# EAGLE schematic uJOVE5 (EAGLE 9.2.1)

## Sheet 1 of 2
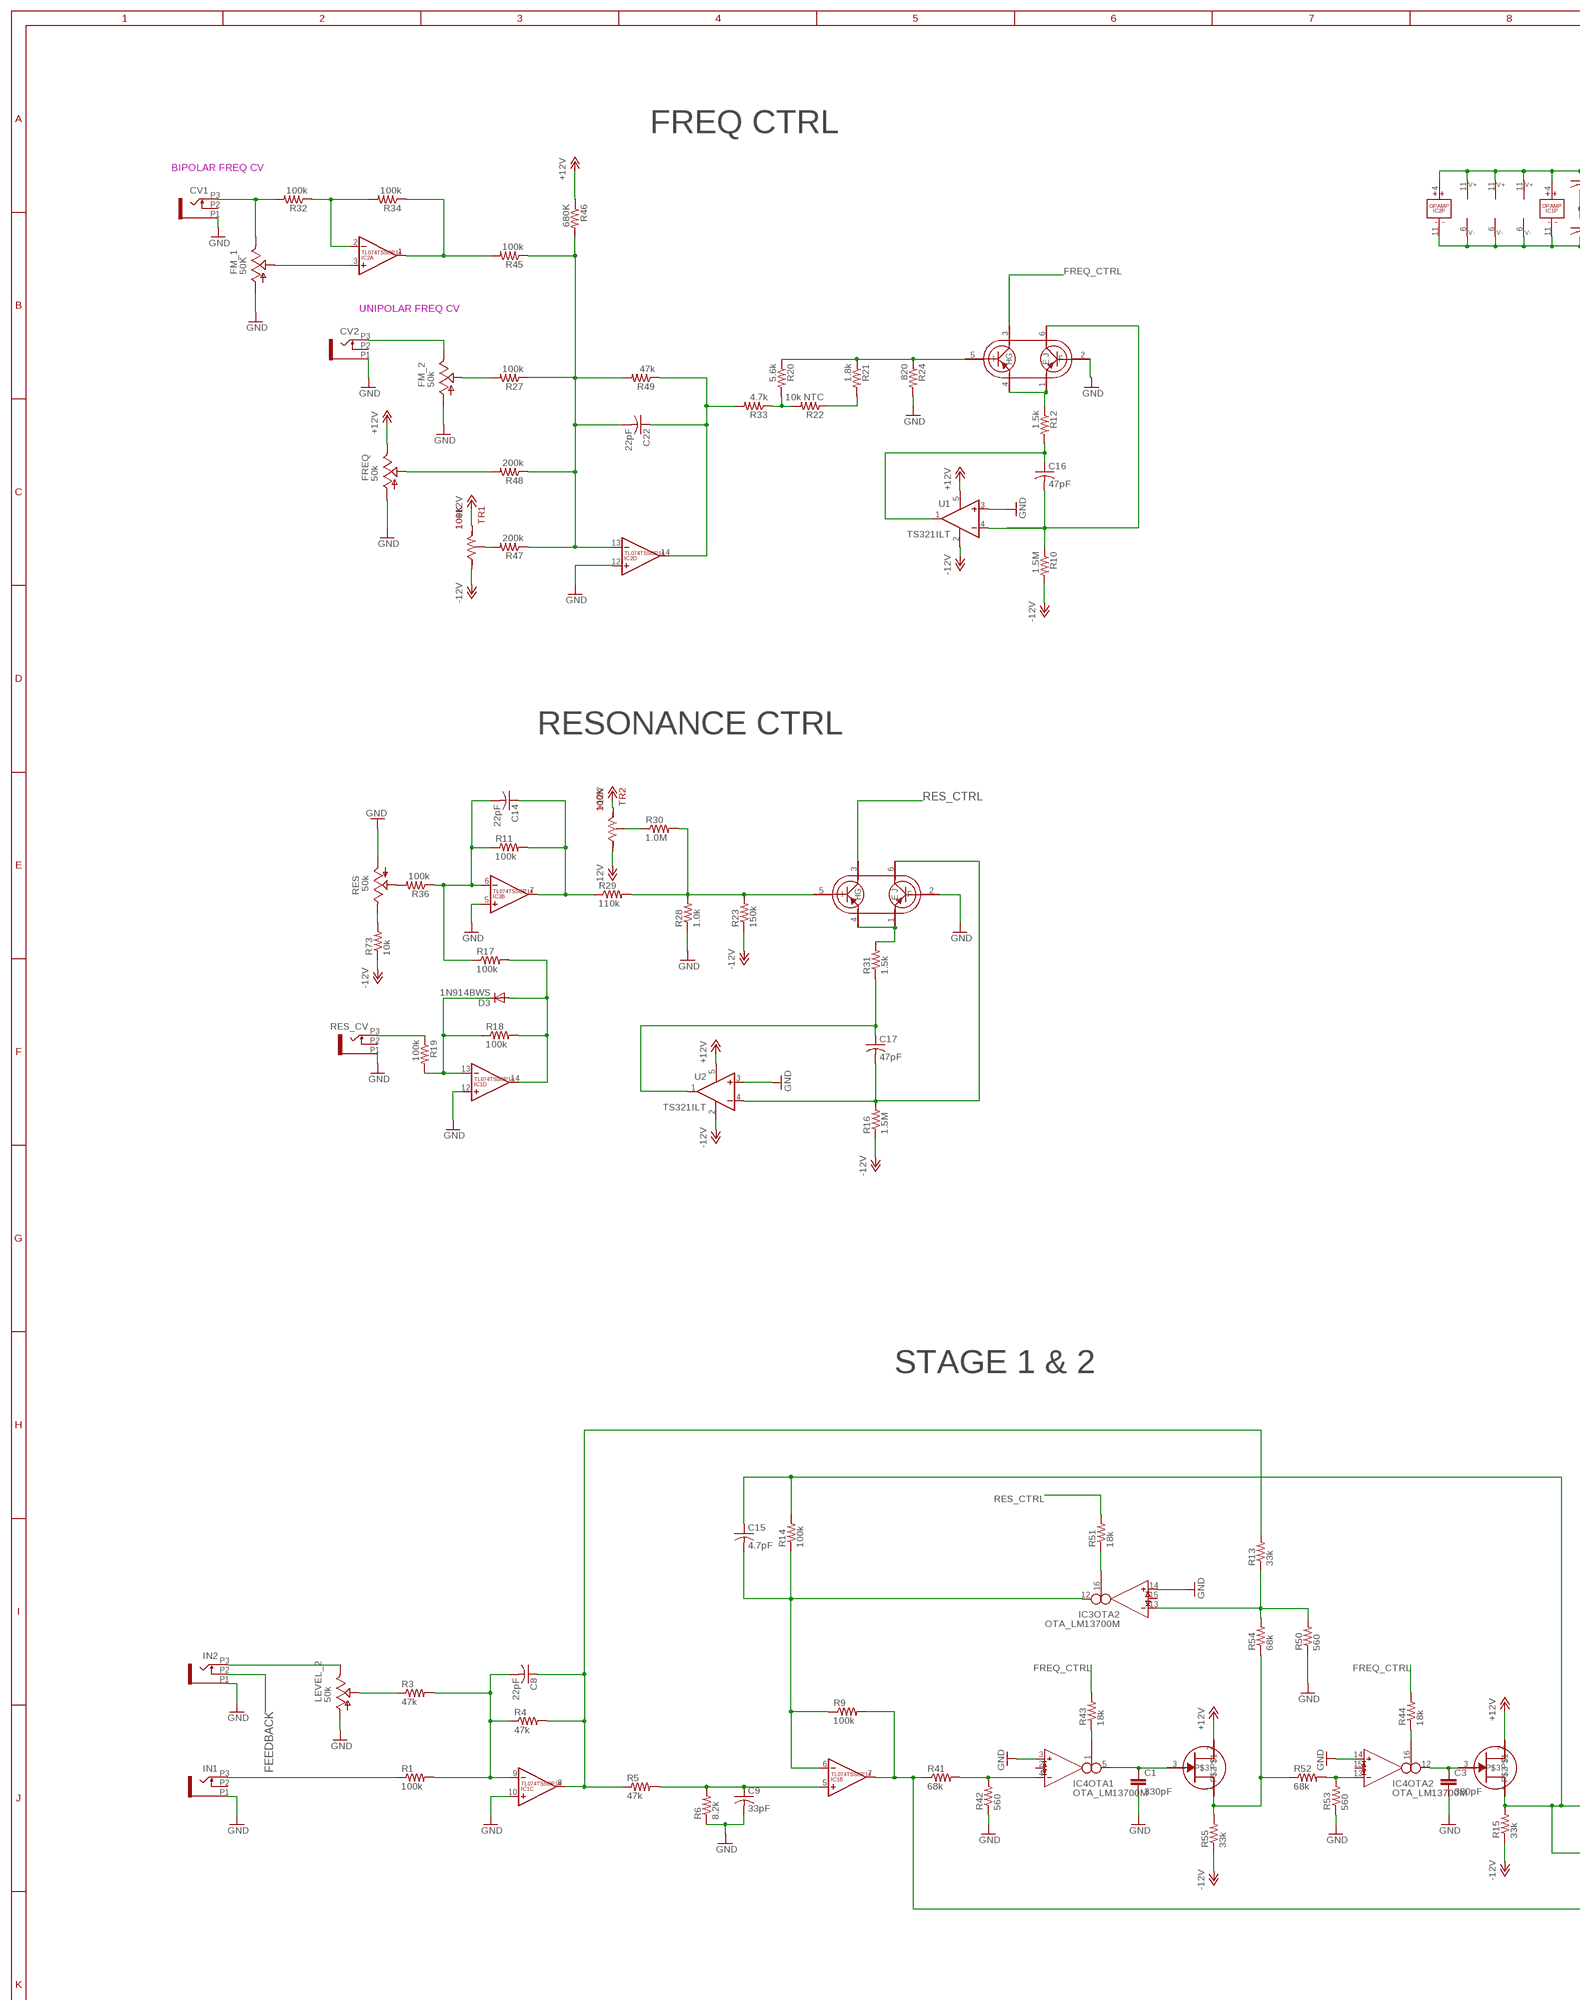
[diagram p0: schematic, sheet 1, part 1 of 3]
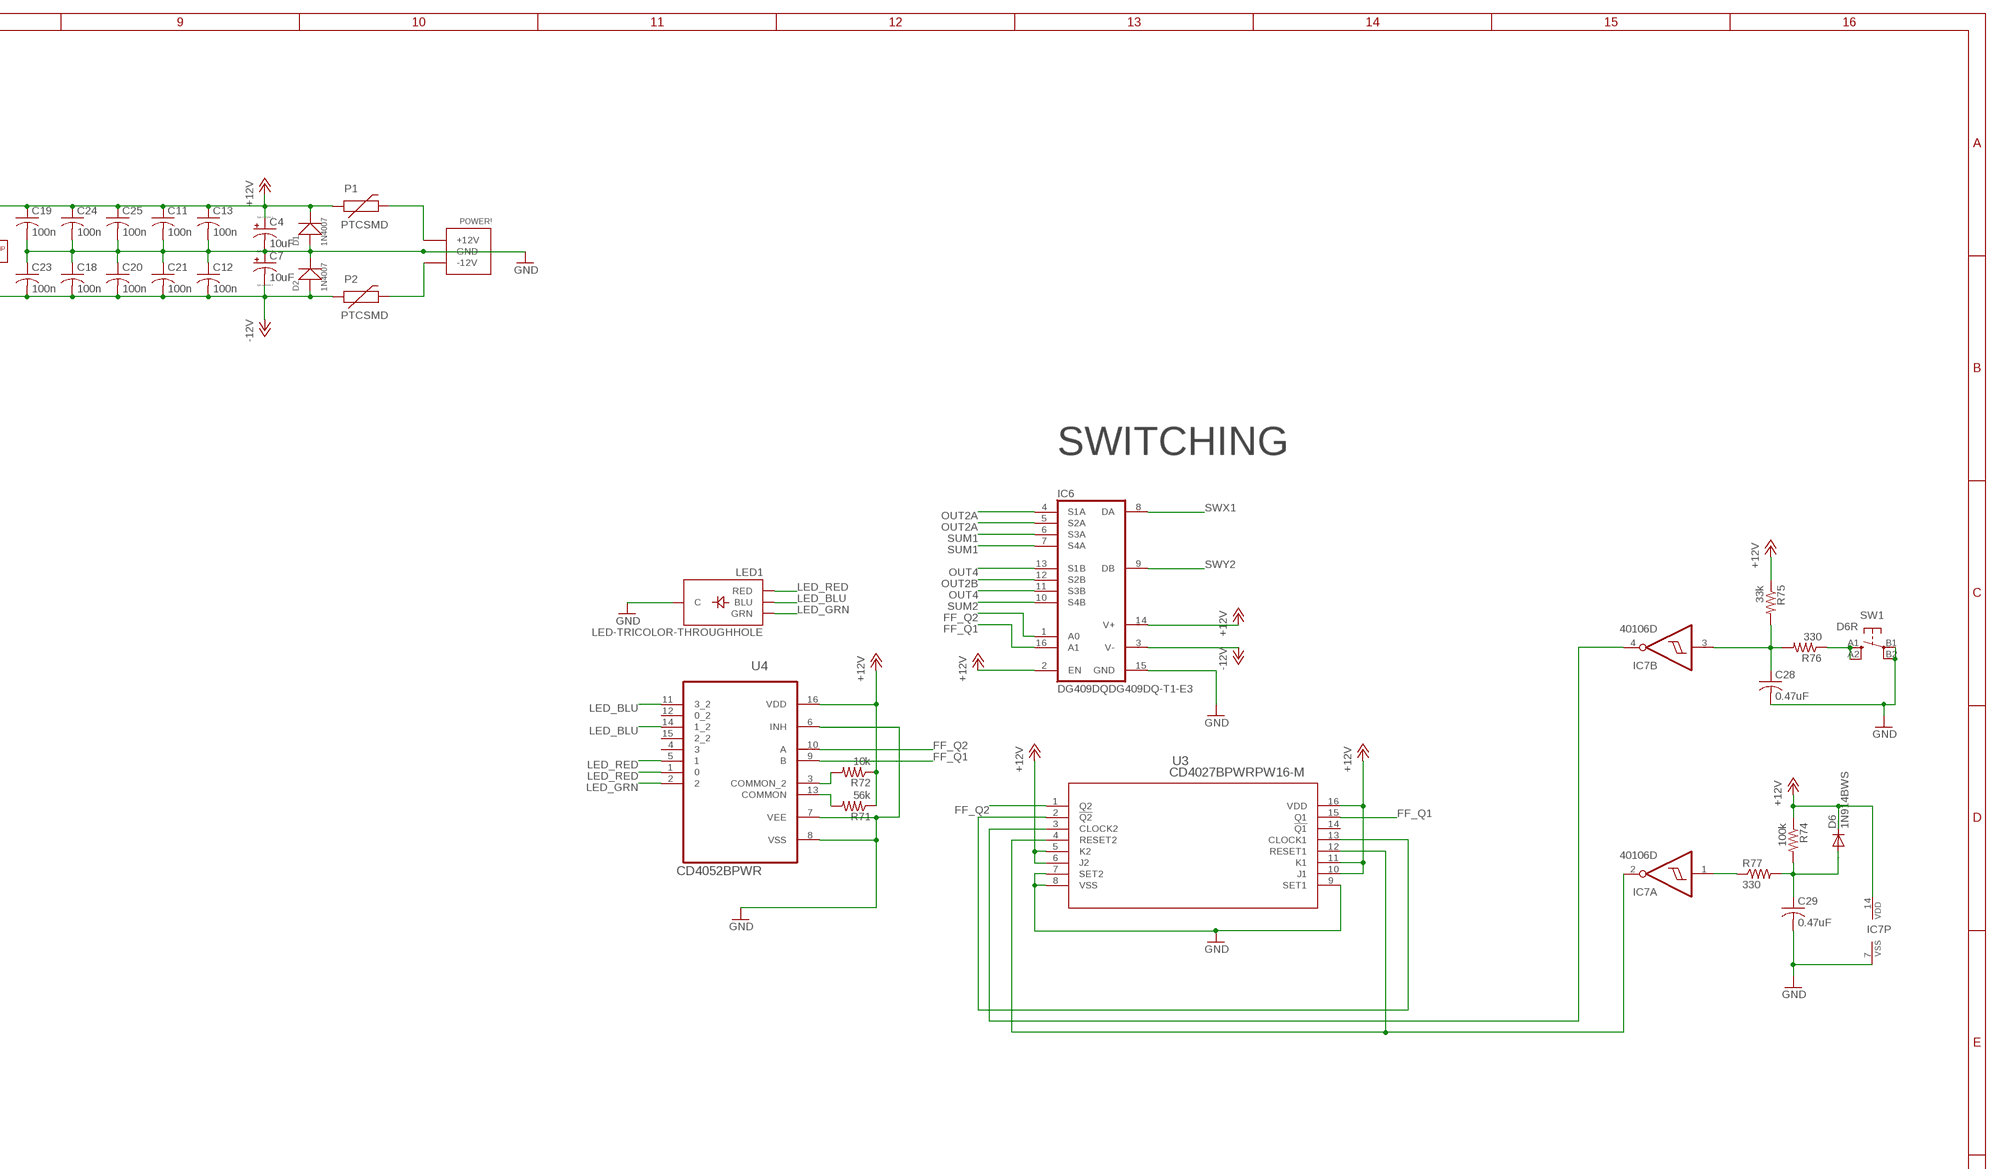
[diagram p1: schematic, sheet 1, part 2 of 3]
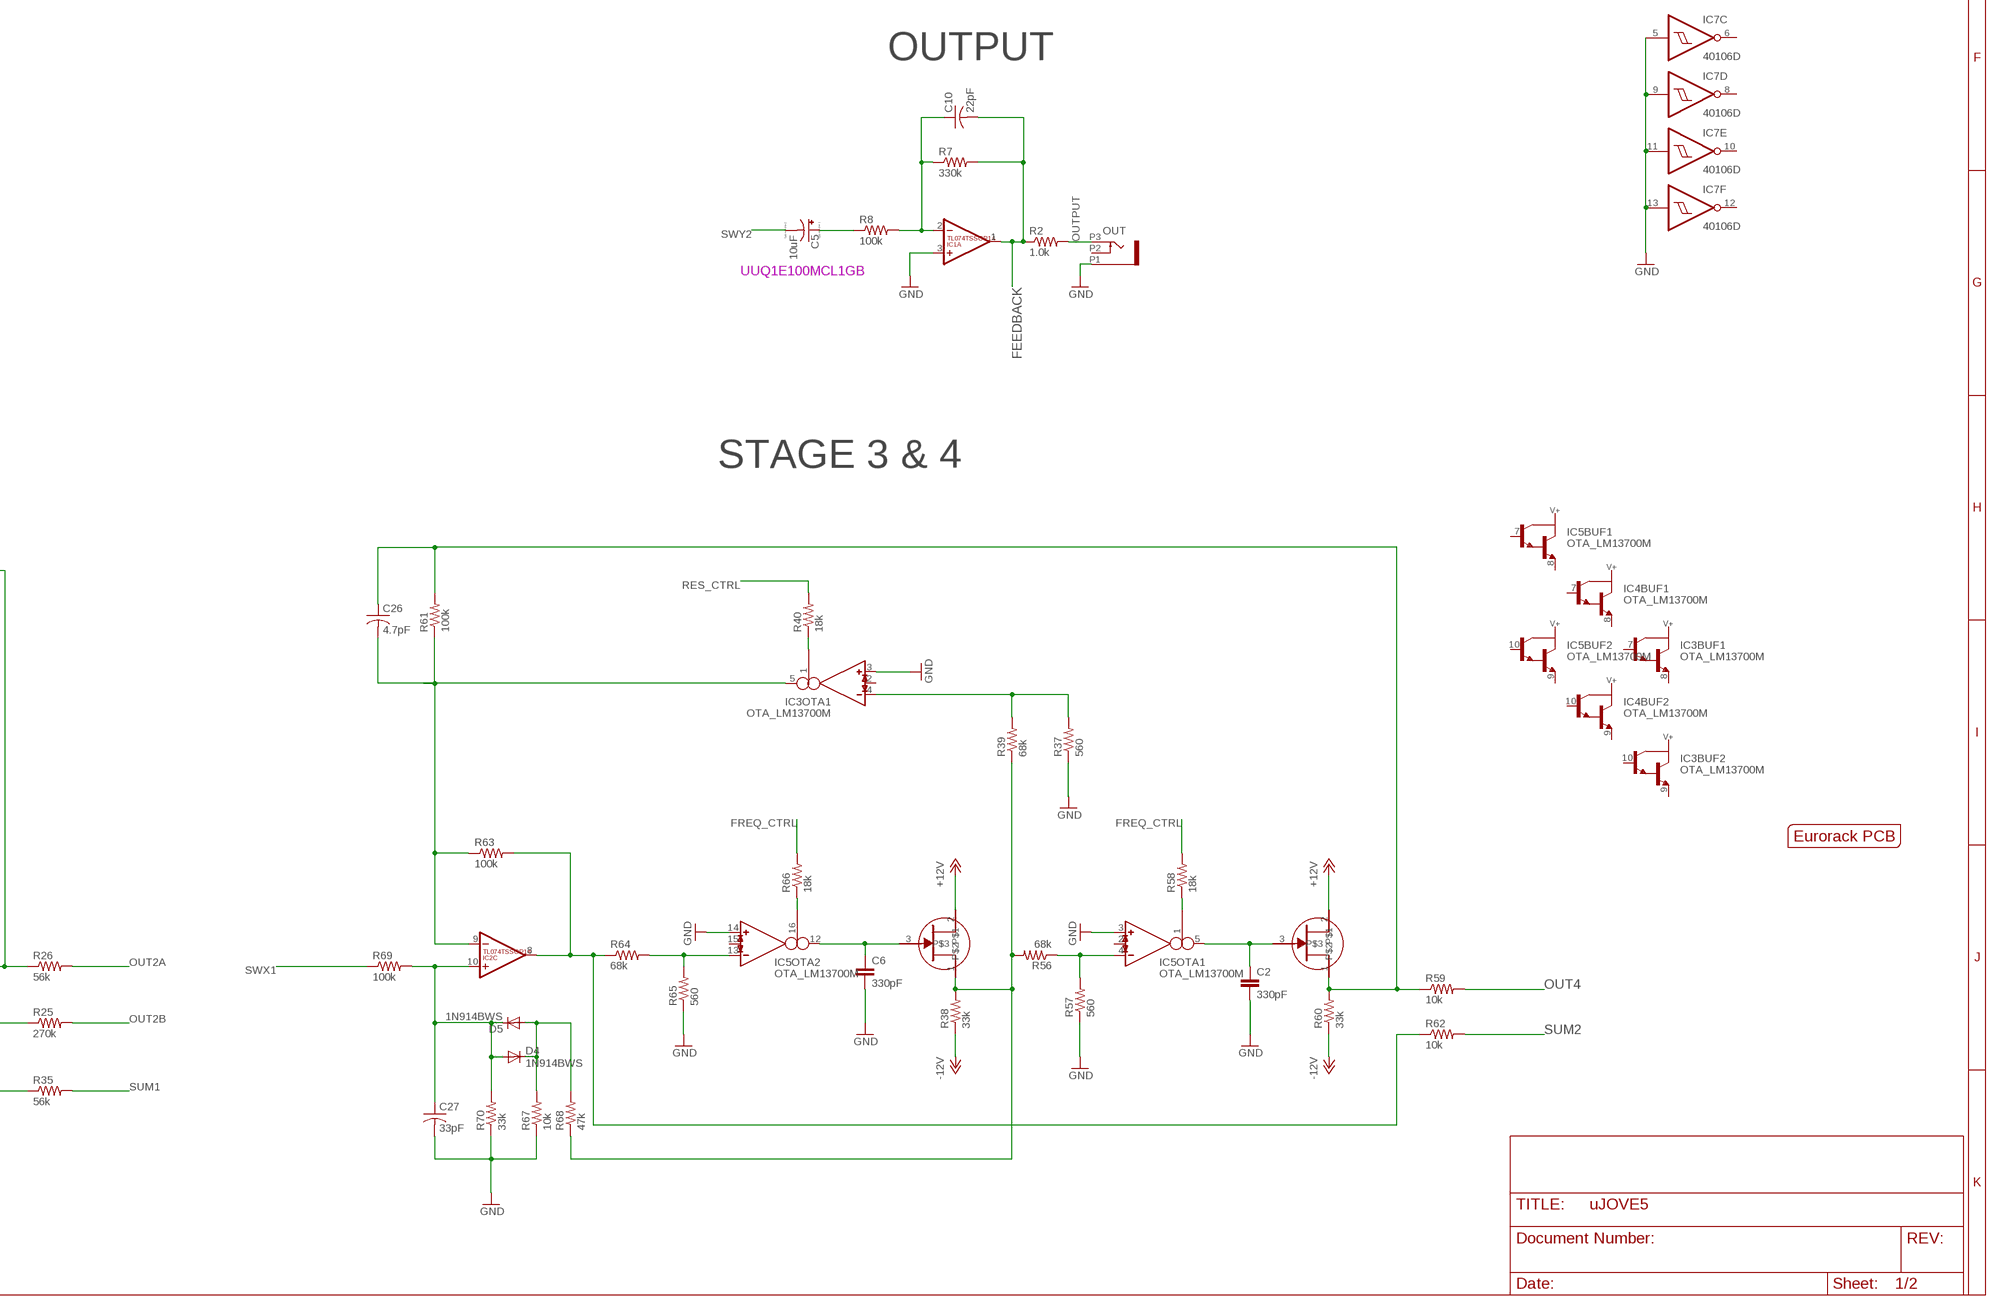
[diagram p2: schematic, sheet 1, part 3 of 3]

### Parts
C1  330pF  C5/5  [C5B5]
C2  330pF  C5/5  [C5B5]
C3  330pF  C5/5  [C5B5]
C4  10uF  CPOL-USC  [PANASONIC_C]
C5  10uF  CPOL-USC  [PANASONIC_C]
C6  330pF  C5/5  [C5B5]
C7  10uF  CPOL-USC  [PANASONIC_C]
C8  22pF  C-USC0603  [C0603]
C9  33pF  C-USC0603  [C0603]
C10  22pF  C-USC0603  [C0603]
C11  100n  C-USC0603  [C0603]
C12  100n  C-USC0603  [C0603]
C13  100n  C-USC0603  [C0603]
C14  22pF  C-USC0603  [C0603]
C15  4.7pF  C-USC0603  [C0603]
C16  47pF  C-USC0603  [C0603]
C17  47pF  C-USC0603  [C0603]
C18  100n  C-USC0603  [C0603]
C19  100n  C-USC0603  [C0603]
C20  100n  C-USC0603  [C0603]
C21  100n  C-USC0603  [C0603]
C22  22pF  C-USC0603  [C0603]
C23  100n  C-USC0603  [C0603]
C24  100n  C-USC0603  [C0603]
C25  100n  C-USC0603  [C0603]
C26  4.7pF  C-USC0603  [C0603]
C27  33pF  C-USC0603  [C0603]
C28  0.47uF  C-USC0603  [C0603]
C29  0.47uF  C-USC0603  [C0603]
CV1  OG-PJ301_PJ301_THONKICONN  [OG-PJ301_WQP_PJ_301M6_NO_HOLE]
CV2  OG-PJ301_PJ301_THONKICONN  [OG-PJ301_WQP_PJ_301M6_NO_HOLE]
D1  1N4007  DIODE-GEN-PURPOSE-1KV-1A(DO-214AC)  [DO-214AC]
D2  1N4007  DIODE-GEN-PURPOSE-1KV-1A(DO-214AC)  [DO-214AC]
D3  1N914BWS  DIODE-SOD323-R  [SOD323-R]
D4  1N914BWS  DIODE-SOD323-R  [SOD323-R]
D5  1N914BWS  DIODE-SOD323-R  [SOD323-R]
D6  1N914BWS  DIODE-SOD323-R  [SOD323-R]
FM_1  50K  OG-POTS_POT_USVERTICAL  [OG-POTS_ALPS_POT_VERTICAL]
FM_2  50k  OG-POTS_POT_USVERTICAL  [OG-POTS_ALPS_POT_VERTICAL]
FREQ  50k  OG-POTS_POT_USVERTICAL_PS  [OG-POTS_ALPS_POT_VERTICAL_PS]
IC1  TL074TSSOP14  [TSSOP14]
IC2  TL074TSSOP14  [TSSOP14]
IC3  OTA_LM13700M  [OTA_SO16]
IC4  OTA_LM13700M  [OTA_SO16]
IC5  OTA_LM13700M  [OTA_SO16]
IC6  DG409DQDG409DQ-T1-E3  [TSSOP16]
IC7  40106D  [SO14]
IN1  OG-PJ301_PJ301_THONKICONN  [OG-PJ301_WQP_PJ_301M6_NO_HOLE]
IN2  OG-PJ301_PJ301_THONKICONN  [OG-PJ301_WQP_PJ_301M6_NO_HOLE]
LED1  LED-TRICOLOR-THROUGHHOLE  [LED-TRICOLOR-THROUGHHOLE]
LEVEL_2  50k  OG-POTS_POT_USVERTICAL  [OG-POTS_ALPS_POT_VERTICAL]
OUT  OG-PJ301_PJ301_THONKICONN  [OG-PJ301_WQP_PJ_301M6_NO_HOLE]
P1  PTCSMD  [PTC-1206]
P2  PTCSMD  [PTC-1206]
PCB1  EURORACK_PCB  [EURORACK8HPPCB-S]
POWER!  POWER_SIMPLE  [2X05_SMT_HEADER]
Q1  BCM857BS  [SOT65P210X110-6N]
Q2  BCM857BS  [SOT65P210X110-6N]
Q3  MMBFJ112MMBFJ112  [SOT23]
Q4  MMBFJ112MMBFJ112  [SOT23]
Q5  MMBFJ112MMBFJ112  [SOT23]
Q6  MMBFJ112MMBFJ112  [SOT23]
R1  100k  R-US_R0603  [R0603]
R2  1.0k  R-US_R0603  [R0603]
R3  47k  R-US_R0603  [R0603]
R4  47k  R-US_R0603  [R0603]
R5  47k  R-US_R0603  [R0603]
R6  8.2k  R-US_R0603  [R0603]
R7  330k  R-US_R0603  [R0603]
R8  100k  R-US_R0603  [R0603]
R9  100k  R-US_R0603  [R0603]
R10  1.5M  R-US_R0603  [R0603]
R11  100k  R-US_R0603  [R0603]
R12  1.5k  R-US_R0603  [R0603]
R13  33k  R-US_R0603  [R0603]
R14  100k  R-US_R0603  [R0603]
R15  33k  R-US_R0603  [R0603]
R16  1.5M  R-US_R0603  [R0603]
R17  100k  R-US_R0603  [R0603]
R18  100k  R-US_R0603  [R0603]
R19  100k  R-US_R0603  [R0603]
R20  5.6k  R-US_R0603  [R0603]
R21  1.8k  R-US_R0603  [R0603]
R22  10k NTC  R-US_R0805  [R0805]
R23  150k  R-US_R0603  [R0603]
R24  820  R-US_R0603  [R0603]
R25  270k  R-US_R0603  [R0603]
R26  56k  R-US_R0603  [R0603]
R27  100k  R-US_R0603  [R0603]
R28  1.0k  R-US_R0603  [R0603]
R29  110k  R-US_R0603  [R0603]
R30  1.0M  R-US_R0603  [R0603]
R31  1.5k  R-US_R0603  [R0603]
R32  100k  R-US_R0603  [R0603]
R33  4.7k  R-US_R0603  [R0603]
R34  100k  R-US_R0603  [R0603]
R35  56k  R-US_R0603  [R0603]
R36  100k  R-US_R0603  [R0603]
R37  560  R-US_R0603  [R0603]
R38  33k  R-US_R0603  [R0603]
R39  68k  R-US_R0603  [R0603]
R40  18k  R-US_R0603  [R0603]
R41  68k  R-US_R0603  [R0603]
R42  560  R-US_R0603  [R0603]
R43  18k  R-US_R0603  [R0603]
R44  18k  R-US_R0603  [R0603]
R45  100k  R-US_R0603  [R0603]
R46  680K  R-US_R0603  [R0603]
R47  200k  R-US_R0603  [R0603]
R48  200k  R-US_R0603  [R0603]
R49  47k  R-US_R0603  [R0603]
R50  560  R-US_R0603  [R0603]
R51  18k  R-US_R0603  [R0603]
R52  68k  R-US_R0603  [R0603]
R53  560  R-US_R0603  [R0603]
R54  68k  R-US_R0603  [R0603]
R55  33k  R-US_R0603  [R0603]
R56  68k  R-US_R0603  [R0603]
R57  560  R-US_R0603  [R0603]
R58  18k  R-US_R0603  [R0603]
R59  10k  R-US_R0603  [R0603]
R60  33k  R-US_R0603  [R0603]
R61  100k  R-US_R0603  [R0603]
R62  10k  R-US_R0603  [R0603]
R63  100k  R-US_R0603  [R0603]
R64  68k  R-US_R0603  [R0603]
R65  560  R-US_R0603  [R0603]
R66  18k  R-US_R0603  [R0603]
R67  10k  R-US_R0603  [R0603]
R68  47k  R-US_R0603  [R0603]
R69  100k  R-US_R0603  [R0603]
R70  33k  R-US_R0603  [R0603]
R71  56k  R-US_R0603  [R0603]
R72  10k  R-US_R0603  [R0603]
R73  10k  R-US_R0603  [R0603]
R74  100k  R-US_R0603  [R0603]
R75  33k  R-US_R0603  [R0603]
R76  330  R-US_R0603  [R0603]
R77  330  R-US_R0603  [R0603]
RES  50k  OG-POTS_POT_USVERTICAL_PS  [OG-POTS_ALPS_POT_VERTICAL_PS]
RES_CV  OG-PJ301_PJ301_THONKICONN  [OG-PJ301_WQP_PJ_301M6_NO_HOLE]
SW1  D6R  [D6R]
TR1  100K  TC33X-2-104E  [TC33X-2]
TR2  100K  TC33X-2-104E  [TC33X-2]
U1  TS321ILT  TS321IDBV  [SOT23-5]
U2  TS321ILT  TS321IDBV  [SOT23-5]
U3  CD4027BPWRPW16-M  [PW16-M]
U4  CD4052BPWR  [SOP65P640X120-16N]

### Nets
+12V: C4.+ C11.1 C13.1 C19.1 C24.1 C25.1 D1.2(-) D6.C FREQ.P$1(E) IC1.4(P:V+) IC2.4(P:V+) IC3.11(SUPPLY:V+) IC4.11(SUPPLY:V+) IC5.11(SUPPLY:V+) IC6.2(EN) IC6.14(V+) IC7.14(P:VDD) P1.1 Q3.2 Q4.2 Q5.2 Q6.2 R46.1 R71.1 R72.1 R74.1 R75.1 TR1.1 TR2.1 U1.5(V+) U2.5(V+) U3.5(K2) U3.6(J2) U3.10(J1) U3.11(K1) U3.16(VDD) U4.16(VDD)
-12V: C7.- C12.2 C18.2 C20.2 C21.2 C23.2 D2.1(+) IC1.11(P:V-) IC2.11(P:V-) IC3.6(SUPPLY:V-) IC4.6(SUPPLY:V-) IC5.6(SUPPLY:V-) IC6.3(V-) P2.1 R10.2 R15.1 R16.1 R23.1 R38.1 R55.1 R60.1 R73.1 TR1.3 TR2.3 U1.2(V-) U2.2(V-)
FEEDBACK: C10.2 IC1.1(A:OUT) IN2.P2 R2.1 R7.2
FF_Q1: IC6.16(A1) U3.15(Q1) U4.9(B)
FF_Q2: IC6.1(A0) U3.1(Q2) U4.10(A)
FREQ_CTRL: Q1.3(G) R43.2 R44.2 R58.2 R66.2
GND: C1.2 C2.2 C3.2 C4.- C6.2 C7.+ C9.2 C11.2 C12.1 C13.2 C18.1 C19.2 C20.1 C21.1 C23.1 C24.2 C25.2 C27.2 C28.2 C29.2 CV1.P1 CV2.P1 D1.1(+) D2.2(-) FM_1.P$3(A) FM_2.P$3(A) FREQ.P$3(A) IC1.3(A:+IN) IC1.10(C:+IN) IC1.12(D:+IN) IC2.5(B:+IN) IC2.12(D:+IN) IC3.3(OTA1:IN_P) IC3.14(OTA2:IN_P) IC4.3(OTA1:IN_P) IC4.14(OTA2:IN_P) IC5.3(OTA1:IN_P) IC5.14(OTA2:IN_P) IC6.15(GND) IC7.5(C:I) IC7.7(P:VSS) IC7.9(D:I) IC7.11(E:I) IC7.13(F:I) IN1.P1 IN2.P1 LED1.GND(C) LEVEL_2.P$3(A) OUT.P1 POWER!.3(GND) POWER!.4(GND) POWER!.5(GND) POWER!.6(GND) POWER!.7(GND) POWER!.8(GND) Q1.2(F) Q2.2(F) R6.1 R24.2 R28.1 R37.1 R42.1 R50.1 R53.1 R57.1 R65.1 R67.1 R70.1 RES.P$3(A) RES_CV.P1 SW1.B1(P) SW1.B2(P1) U1.3(+IN) U2.3(+IN) U3.7(SET2) U3.8(VSS) U3.9(SET1) U4.6(INH) U4.7(VEE) U4.8(VSS)
LED_BLU: LED1.BLU U4.11(3_2) U4.14(1_2)
LED_GRN: LED1.GRN U4.2
LED_RED: LED1.RED U4.1 U4.5
N$1: P1.2 POWER!.9(+12V) POWER!.10(+12V)
N$2: P2.2 POWER!.1(-12V) POWER!.2(-12V)
N$3: IN1.P3 R1.1
N$4: C8.2 IC1.9(C:-IN) R1.2 R3.2 R4.1
N$5: IN2.P3 LEVEL_2.P$1(E)
N$6: LEVEL_2.P$2(S) R3.1
N$7: C8.1 IC1.8(C:OUT) R4.2 R5.1 R13.2
N$8: C9.1 IC1.5(B:+IN) R5.2 R6.2
N$9: IC1.7(B:OUT) R9.2 R35.1 R41.1
N$10: C15.2 IC1.6(B:-IN) IC3.12(OTA2:OUT) R9.1 R14.1
N$11: IC4.4(OTA1:IN_N) R41.2 R42.2
N$12: IC4.1(OTA1:I_BIAS) R43.1
N$13: C1.1 IC4.5(OTA1:OUT) Q4.3
N$14: IC4.13(OTA2:IN_N) R52.2 R53.2
N$15: IC3.13(OTA2:IN_N) R13.1 R50.2 R54.2
N$16: IC3.16(OTA2:I_BIAS) R51.1
N$17: C15.1 Q3.1 R14.2 R15.2 R25.1 R26.1
N$18: Q4.1 R52.1 R54.1 R55.2
N$19: IC4.16(OTA2:I_BIAS) R44.1
N$20: R73.2 RES.P$1(E)
N$21: C3.1 IC4.12(OTA2:OUT) Q3.3
N$22: C5.+ R8.1
N$23: C10.1 IC1.2(A:-IN) R7.1 R8.2
N$24: C29.1 D6.A R74.2 R77.2
N$25: IC2.8(C:OUT) R62.1 R63.2 R64.1
N$26: IC5.4(OTA1:IN_N) R56.1 R57.2
N$27: D4.C D5.A R67.2 R68.2
N$28: C27.1 D4.A D5.C IC2.10(C:+IN) R69.2 R70.2
N$29: IC5.13(OTA2:IN_N) R64.2 R65.2
N$30: IC3.4(OTA1:IN_N) R37.2 R39.2
N$31: IC5.16(OTA2:I_BIAS) R66.1
N$32: C6.1 IC5.12(OTA2:OUT) Q6.3
N$33: Q6.1 R38.2 R39.1 R56.2 R68.1
N$34: IC3.1(OTA1:I_BIAS) R40.1
N$35: C26.2 IC2.9(C:-IN) IC3.5(OTA1:OUT) R61.1 R63.1
N$36: R36.2 RES.P$2(S)
N$37: IC5.1(OTA1:I_BIAS) R58.1
N$38: C26.1 Q5.1 R59.1 R60.2 R61.2
N$39: C2.1 IC5.5(OTA1:OUT) Q5.3
N$40: R19.1 RES_CV.P3
N$41: D3.C IC1.13(D:-IN) R18.1 R19.2
N$42: D3.A IC1.14(D:OUT) R17.2 R18.2
N$43: C14.2 IC2.6(B:-IN) R11.1 R17.1 R36.1
N$44: R30.1 TR2.2
N$45: C14.1 IC2.7(B:OUT) R11.2 R29.1
N$46: Q2.5(I) R23.2 R28.2 R29.2 R30.2
N$47: Q2.1(E) Q2.4(H) R31.2
N$48: C17.2 Q2.6(J) R16.2 U2.4(-IN)
N$49: C17.1 R31.1 U2.1(OUT)
N$50: CV1.P3 FM_1.P$1(E) R32.2
N$51: IC2.2(A:-IN) R32.1 R34.2
N$52: FM_1.P$2(S) IC2.3(A:+IN)
N$53: IC2.1(A:OUT) R34.1 R45.2
N$54: C22.2 IC2.13(D:-IN) R27.1 R45.1 R46.2 R47.1 R48.1 R49.2
N$55: CV2.P3 FM_2.P$1(E)
N$56: FM_2.P$2(S) R27.2
N$57: FREQ.P$2(S) R48.2
N$58: R47.2 TR1.2
N$59: C22.1 IC2.14(D:OUT) R33.2 R49.1
N$60: R20.2 R22.2 R33.1
N$61: Q1.5(I) R20.1 R21.1 R24.1
N$62: R21.2 R22.1
N$63: C16.2 Q1.6(J) R10.1 U1.4(-IN)
N$64: Q1.1(E) Q1.4(H) R12.1
N$65: C16.1 R12.2 U1.1(OUT)
N$66: IC7.1(A:I) R77.1
N$67: C28.1 IC7.3(B:I) R75.2 R76.2
N$68: IC7.2(A:O) U3.4(RESET2) U3.12(RESET1)
N$70: IC7.4(B:O) U3.3(CLOCK2)
N$71: R76.1 SW1.A1(S) SW1.A2(S1)
N$72: U3.2(!Q2) U3.13(CLOCK1)
N$73: R72.2 U4.3(COMMON_2)
N$74: R71.2 U4.13(COMMON)
OUT2A: IC6.4(S1A) IC6.5(S2A) R26.2
OUT2B: IC6.12(S2B) R25.2
OUT4: IC6.11(S3B) IC6.13(S1B) R59.2
OUTPUT: OUT.P3 R2.2
RES_CTRL: Q2.3(G) R40.2 R51.2
SUM1: IC6.6(S3A) IC6.7(S4A) R35.2
SUM2: IC6.10(S4B) R62.2
SWX1: IC6.8(DA) R69.1
SWY2: C5.- IC6.9(DB)
Unconnected: CV1.P2 CV2.P2 IC3.2(OTA1:I_DIODE) IC3.7(BUF1:B) IC3.8(BUF1:E) IC3.9(BUF2:E) IC3.10(BUF2:B) IC3.15(OTA2:I_DIODE) IC4.2(OTA1:I_DIODE) IC4.7(BUF1:B) IC4.8(BUF1:E) IC4.9(BUF2:E) IC4.10(BUF2:B) IC4.15(OTA2:I_DIODE) IC5.2(OTA1:I_DIODE) IC5.7(BUF1:B) IC5.8(BUF1:E) IC5.9(BUF2:E) IC5.10(BUF2:B) IC5.15(OTA2:I_DIODE) IC7.6(C:O) IC7.8(D:O) IC7.10(E:O) IC7.12(F:O) IN1.P2 OUT.P2 RES_CV.P2 U3.14(!Q1) U4.4 U4.12(0_2) U4.15(2_2)

### Notes on the sheet
- FREQ CTRL
- BIPOLAR FREQ CV
- UNIPOLAR FREQ CV
- SWITCHING
- RESONANCE CTRL
- OUTPUT
- UUQ1E100MCL1GB
- STAGE 1 & 2
- STAGE 3 & 4

## Sheet 2 of 2

## Library data of the parts
C1-C3 C6 = capacitor-wima:C: CAPACITOR naming: grid - package width
C4 C5 C7 = resistor:CPOL-US: POLARIZED CAPACITOR, American symbol
C8-C29 = resistor:C-US: CAPACITOR, American symbol
CV1 CV2 IN1 IN2 OUT RES_CV = SHAY_THONKICONNS:OG-PJ301_PJ301_THONKICONN
D1 D2 = Seeed-Diode:DIODE-GEN-PURPOSE-1KV-1A(DO-214AC): 304010013; MPN: 1N4007
D3-D6 = diode:DIODE-: DIODE
FM_1 FM_2 FREQ LEVEL_2 RES = elements_v02:OG-POTS_POT_US
IC1 IC2 = EurorackModularParts:TL074: OP AMP
IC3-IC5 = wavelet6:OTA_LM13700: Dual OTA with buffers
IC6 = maxim:DG409DQ: ANALOG MULTIPLEXER
IC7 = 40xx:40106: Hex SCHMITT TRIGGER
LED1 = og-leds:LED-TRICOLOR-THROUGHHOLE
P1 P2 = SparkFun:PTC: Resettable Fuse PTC Resettable Fuse. Spark Fun Electronics SKU : COM-08357
PCB1 = EurorackModularParts:EURORACK_PCB
POWER! = EurorackModularParts:POWER_SIMPLE
Q1 Q2 = BCM857BS:BCM857BS: NEXPERIA - BCM857BS - TRANSISTOR, MATCHED, SOT-363 Source: Datasheet <https://assets.nexperia.com/documents/data-sheet/BCM857BV_BS_DS.pdf>; ARROW_PART_NUMBER: BCM857BS; DESCRIPTION: NEXPERIA - BCM857BS - TRANSISTOR, MATCHED, SOT-363; HEIGHT: 1.1mm; MANUFACTURER_NAME: Nexperia; MANUFACTURER_PART_NUMBER: BCM857BS
Q3-Q6 = MMBFJ112:MMBFJ112
R1-R21 R23-R77 = rcl:R-US_: RESISTOR, American symbol; SPICEPREFIX: R
R22 = resistor:R-US_: RESISTOR, American symbol
SW1 = og-switch:D6R: C&K D6R
TR1 TR2 = TC33X-2-104E:TC33X-2-104E: Cermet 3mm SMT trimmer,0.1W 100k Bourns TC33 Series SMD Cermet Trimmer Resistor with Solder Pad Terminations, 100k 25% 1/10W 250ppm/C Top Adjust Source: Datasheet <http://www.bourns.com/docs/Product-Datasheets/TC33.pdf>; ALLIED_NUMBER: 70155236; ALLIED_PRICE-STOCK: https://www.alliedelec.com/bourns-tc33x-2-104e/70155236/; ARROW_PART_NUMBER: TC33X-2-104E; ARROW_PRICE-STOCK: https://www.arrow.com/en/products/tc33x-2-104e/bourns; DESCRIPTION: Cermet 3mm SMT trimmer,0.1W 100k Bourns TC33 Series SMD Cermet Trimmer Resistor with Solder Pad Terminations, 100k 25% 1/10W 250ppm/C Top Adjust; HEIGHT: mm; MANUFACTURER_NAME: Bourns; MANUFACTURER_PART_NUMBER: TC33X-2-104E; RS_PART_NUMBER: 1673550; RS_PRICE-STOCK: http://uk.rs-online.com/web/p/products/1673550
U1 U2 = TS321I:TS321I; AVAILABILITY: Unavailable; MF: STMicroelectronics; MP: TS321I; PACKAGE: None; PRICE: None
U3 = CD4027BPWR:CD4027BPWR; MANUFACTURER_PART_NUMBER: CD4027BPWR; VENDOR: Vendor
U4 = CD4052BPWR:CD4052BPWR: single 8-Channel multiplexer; AVAILABILITY: Unavailable; DESCRIPTION: CMOS Differential 4-Channel Analog Multiplexer/Demultiplexer with Logic-Level Conversion 16-TSSOP -55 to 125; MF: Texas Instruments; MP: CD4052BPWR; PACKAGE: TSSOP-16 Texas Instruments; PRICE: None